# Altium schematic sheet 1N4148W.schdoc
size 127 x 101 mm
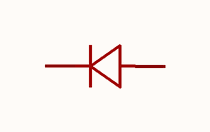
[diagram p0: 1N4148W.schdoc]

## Parts
D?  1N4148W  [SOD-123_L2.7-W1.7-LS3.8-RD]  (value not drawn)

## Nets

Not connected (* = marked no-connect by the designer): D? 1(K) 2(A)

## Library data of the parts
D? = 1N4148W_C2840961: Manufacturer: Agertech(艾吉芯); Add into BOM: yes; Forward Voltage (Vf@If): 1.25V@150mA; Reverse Leakage Current: 1uA@75V; Symbol: 1N4148W_C2840961; Device: 1N4148W_C2840961; LCSC Part Name: 电压:100V 电流:150mA; Supplier Part: C2840961; Manufacturer Part: 1N4148W; Supplier Footprint: SOD-123W; JLCPCB Part Class: Extended Part; Datasheet: https://atta.szlcsc.com/upload/public/pdf/source/20210624/C2840961_71DFB6950E76A457E5EE196072A9BD23.pdf; Supplier: LCSC; Convert to PCB: yes; Operating Temperature: -55℃~+150℃@(Tj)